# Altium project 2560_TrainingKit.PrjPcb (part 4 of 4)

## Sheet [08] - TK2560_Relay.SchDoc: 2560_TrainingKit
size A4; SheetNumber: 9; SheetTotal: 15
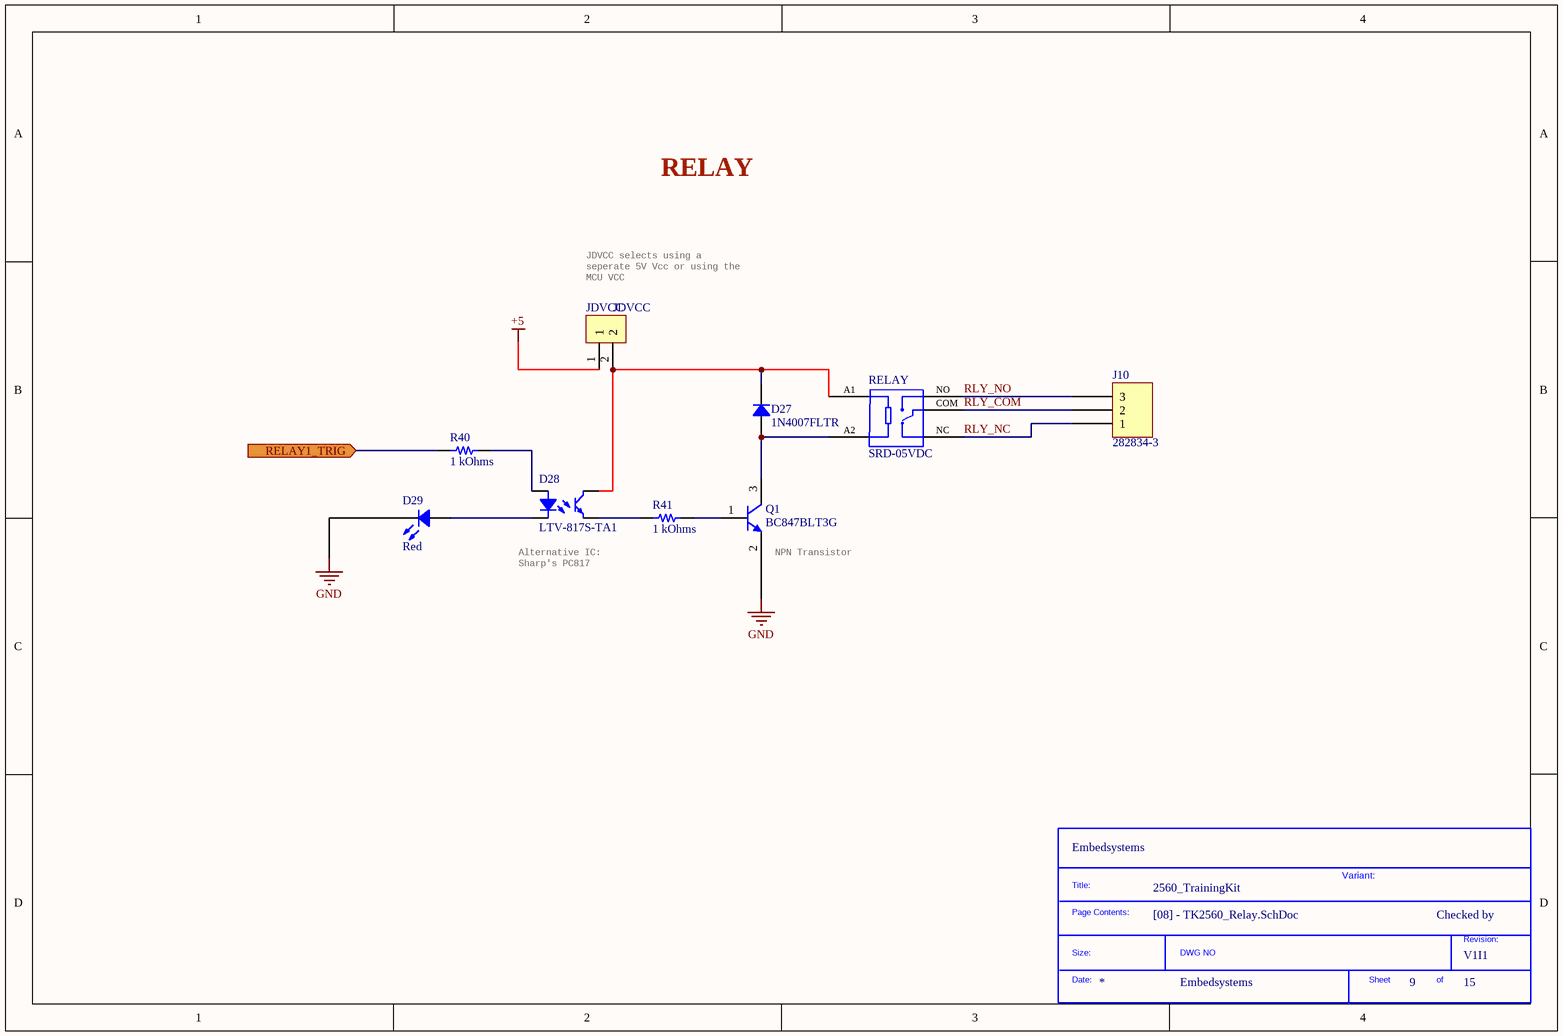
[diagram p11: [08] - TK2560_Relay.SchDoc]

### Parts
(Parts that share a designator on the sheet are numbered #1, #2 ... from top to bottom, then left to right.)
*?#9  SDTitleBlock  (value not drawn)  (graphical)
D27  1N4007FLTR  [SOD123F]
D28  LTV-817S-TA1  [LITEON LTV-817]
D29  Red  [LED 1206_3216 RED]
J10  282834-3  [TE 282834-3]
JDVCC  JDVCC  [HDR_1x2]
Q1  BC847BLT3G  [ON SEMI SOT-23-3]
R40  1 kOhms  [RES 0805_2012]
R41  1 kOhms  [RES 0805_2012]
RELAY  SRD-05VDC  [SRD-05VDC]

### Ports
RELAY1_TRIG (in)

### Nets
+5: JDVCC.1
GND: D29.2 Q1.2(E)
RELAY1_TRIG: R40.2 ; port RELAY1_TRIG
RLY_COM: J10.2 RELAY.COM
RLY_NC: J10.1 RELAY.NC
RLY_NO: J10.3 RELAY.NO
NetD27_1: D27.1 Q1.3(C) RELAY.A2
NetD27_2: D27.2 D28.4 JDVCC.2 RELAY.A1
NetD28_1: D28.1 R40.1
NetD28_2: D28.2 D29.1
NetD28_3: D28.3 R41.2
NetQ1_1: Q1.1(B) R41.1

### Notes on the sheet
- RELAY
- JDVCC selects using a seperate 5V Vcc or using the MCU VCC
- (near D28) Alternative IC: Sharp's PC817
- (near Q1) NPN Transistor
- Variant:
- Checked by
- (in symbol SDTitleBlock) Title:; Page Contents:; Revision:; Size:; DWG NO; Date:; Sheet; of

### Library data of the parts
D27 = 1N4007FLTR: STANDARD RECTIFIER 1000V SOD-123; Manufacturer: SMC Diode Solutions; Capacitance @ Vr, F: 15pF @ 4V, 1MHz; Current - Average Rectified (Io): 1A; Current - Reverse Leakage @ Vr: 5µA @ 1000V; Speed: Standard Recovery >500ns, > 200mA (Io); Voltage - Forward (Vf) (Max) @ If: 1.1V @ 1A; Part Number: 1N4007FLTR; ComponentLink1Description: Datasheet; ComponentLink1URL: http://www.smc-diodes.com/propdf/1N4001FL-1N4007FL%20N1646%20REV.A.pdf; ComponentLink2Description: DigiKey Link; ComponentLink2URL: http://digikey.com/product-detail/en/smc-diode-solutions/1N4007FLTR/1655-1N4007FLCT-ND/11657827; Diode Type: Standard; LastUpdated: 30/08/2020 20:59:55; Lifecycle Status: Active; Minimum Order: 1; Mounting Type: Surface Mount; Package / Case: SOD-123F; Packaging: TapeAndReel; PartId: 3314; Price: 0.01; Supplier 1: DigiKey; Supplier Part Number 1: 1655-1N4007FLCT-ND; Supplier Device Package: SOD-123FL; Voltage - DC Reverse (Vr) (Max): 1000V
D28 = LTV-817S-TA1: OPTOISOLATR 5KV TRANSISTOR 4-SMD; Manufacturer: Lite-On Inc.; Current - DC Forward (If) (Max): 50mA; Current Transfer Ratio (Max): 600% @ 5mA; Current Transfer Ratio (Min): 50% @ 5mA; Input Type: DC; Number of Channels: 1; Rise / Fall Time (Typ): 4µs, 3µs; Vce Saturation (Max): 200mV; Voltage - Forward (Vf) (Typ): 1.2V; Voltage - Isolation: 5000Vrms; Voltage - Output (Max): 35V; Part Number: LTV-817S-TA1; ComponentLink1Description: Datasheet; ComponentLink1URL: http://optoelectronics.liteon.com/upload/download/DS-70-96-0016/LTV-8X7%20series%20201610%20.pdf; ComponentLink2Description: DigiKey Link; ComponentLink2URL: http://digikey.com/product-detail/en/lite-on-inc/LTV-817S-TA1/160-1893-1-ND/3306757; Current - Output / Channel: 50mA; Device Package: 4-SMD, Gull Wing; LastUpdated: 12/01/2020 21:58:48; Lifecycle Status: Active; Minimum Order: 1; Mounting Type: Surface Mount; Operating Temperature: -30°C ~ 110°C; Output Type: Transistor; Package / Case: 4-SMD, Gull Wing; Packaging: TapeAndReel; Part Status: Active; Price: 0.12; Series: -; Supplier 1: DigiKey; Supplier Part Number 1: 160-1893-1-ND; Supplier Device Package: 4-SMD
D29 = XZMDK55W-A2RT: LED RED CLEAR 2SMD; Manufacturer: SunLED; Configuration: Standard; Current - Test: 20mA; Lens Color: Colorless; Lens Size: 1.10mm Dia; Lens Style: Round with Flat Top; Millicandela Rating: 228mcd; Viewing Angle: 70°; Voltage - Forward (Vf) (Typ): 1.95V; Wavelength - Dominant: 630nm; Wavelength - Peak: 645nm; Part Number: XZMDK55W-A2RT; Color: Red; ComponentLink1Description: Datasheet; ComponentLink1URL: https://www.sunledusa.com/products/spec/XZMDK55W-A2RT.pdf; ComponentLink2Description: DigiKey Link; ComponentLink2URL: http://digikey.com/product-detail/en/sunled/XZMDK55W-A2RT/1497-1289-1-ND/5775269; Device Package: 1206 (3216 Metric); Height (Max): 1.20mm; LastUpdated: 02/09/2020 01:21:09; Lens Transparency: Clear; Lifecycle Status: Active; Minimum Order: 1; Mounting Type: Surface Mount; Package / Case: 1206 (3216 Metric); Packaging: TapeAndReel; PartId: 183; Part Status: Active; Price: 0.08; Series: -; Size / Dimension: 3.20mm L x 1.60mm W; Supplier 1: DigiKey; Supplier Part Number 1: 1497-1289-1-ND; Supplier Device Package: 2-SMD; Value: Red
J10 = 282834-3: TERM BLK 3P SIDE ENT 2.54MM PCB; Manufacturer: TE Connectivity AMP Connectors; Current: 10A; Mating Orientation: Horizontal with Board; Number of Levels: 1; Pitch: 0.100" (2.54mm); Positions Per Level: 3; Voltage: 150V; Wire Gauge: 16-30 AWG; Wire Termination: Screw - Rising Cage Clamp; Part Number: 282834-3; Color: Green; ComponentLink1Description: Datasheet; ComponentLink1URL: https://www.te.com/commerce/DocumentDelivery/DDEController?Action=srchrtrv&DocNm=282834&DocType=Customer+Drawing&DocLang=English; ComponentLink2Description: DigiKey Link; ComponentLink2URL: http://digikey.com/product-detail/en/te-connectivity-amp-connectors/282834-3/A98334-ND/1153264; LastUpdated: 15/01/2020 04:15:50; Lifecycle Status: Active; Minimum Order: 1; Mounting Type: Through Hole; Packaging: Bulk; Part Status: Active; Price: 2.01; Series: Buchanan; Supplier 1: DigiKey; Supplier Part Number 1: A98334-ND
JDVCC = HDR_1x2: Pin Header 2.54MM Pitch Str, 1X2PIN, Full G/f, NY6T, 6.1MM*2.5MM*3.0MM / Bag; Manufacturer: Amphenol; Manufacturer Part Number: G800W306018EU; Supplier 1: Mouser; Stock 1: 1088; Pricing 1: 1=0.10000, 10=0.02700, 50=0.02700, 100=0.02600, 1000=0.02200, 10000=0.01900 (USD); RoHS Compliant: Yes; Supplier Part Number 1: 523-G800W306018EU
Q1 = BC847BLT3G: TRANS NPN 45V 0.1A SOT-23; Manufacturer: ON Semiconductor; Current - Collector Cutoff (Max): 15nA (ICBO); Current - Collector (Ic) (Max): 100mA; DC Current Gain (hFE) (Min) @ Ic, Vce: 200 @ 2mA, 5V; Frequency - Transition: 100MHz; Power - Max: 300mW; Vce Saturation (Max) @ Ib, Ic: 600mV @ 5mA, 100mA; Part Number: BC847BLT3G; ComponentLink1Description: Datasheet; ComponentLink1URL: http://www.onsemi.com/pub/Collateral/BC846ALT1-D.PDF; ComponentLink2Description: DigiKey Link; ComponentLink2URL: http://digikey.com/product-detail/en/on-semiconductor/BC847BLT3G/BC847BLT3GOSCT-ND/2704957; LastUpdated: 02/09/2020 01:30:08; Lifecycle Status: Active; Minimum Order: 1; Mounting Type: Surface Mount; Operating Temperature: -55°C ~ 150°C (TJ); Package / Case: TO-236-3, SC-59, SOT-23-3; Packaging: TapeAndReel; PartId: 157; Part Status: Active; Price: 0.02; Series: -; Supplier 1: DigiKey; Supplier Part Number 1: BC847BLT3GOSCT-ND; Supplier Device Package: SOT-23-3 (TO-236); Transistor Type: NPN; Voltage - Collector Emitter Breakdown (Max): 45V
R40 R41 = RNCP0805FTD1K00: RES 1K OHM 1% 1/4W 0805; Manufacturer: Stackpole Electronics Inc; Power (Watts): 0.25W, 1/4W; Temperature Coefficient: ±100ppm/°C; Part Number: RNCP0805FTD1K00; Value: 1 kOhms; ComponentLink1Description: Datasheet; ComponentLink1URL: https://www.seielect.com/catalog/sei-rncp.pdf; ComponentLink2Description: DigiKey Link; ComponentLink2URL: http://digikey.com/product-detail/en/stackpole-electronics-inc/RNCP0805FTD1K00/RNCP0805FTD1K00CT-ND/2240568; Composition: Thin Film; Device Package: 0805 (2012 Metric); Features: Anti-Sulfur, Moisture Resistant; Height - Seated (Max): 0.024" (0.60mm); LastUpdated: 02/09/2020 01:15:23; Lifecycle Status: Active; Minimum Order: 1; Number of Terminations: 2; Operating Temperature: -55°C ~ 155°C; Package / Case: 0805 (2012 Metric); Packaging: TapeAndReel; PartId: 28023; Part Status: Active; Price: 0.01; Resistance: 1 kOhms; Series: RNCP; Size / Dimension: 0.079" L x 0.049" W (2.00mm x 1.25mm); Supplier 1: DigiKey; Supplier Part Number 1: RNCP0805FTD1K00CT-ND; Supplier Device Package: 0805; Tolerance: ±1%
RELAY = SRD-05VDC: TE CONNECTIVITY - 1-1721150-0 - POWER RELAY, SPDT, 277VAC, 10A, TH; Manufacturer: TE Connectivity P&B; Contact Current Rating: 15A; Coil Voltage (DC): 5V; Voltage Rating (AC): 125V; Manufacturer Part Number: 1-1721150-0; RoHS: Yes; Category: Signal Relays; Stock 1: 9261; Pricing 1: 1=1.34000, 10=1.26000, 25=1.12000, 50=1.06400, 100=1.00800, 250=0.89600, 500=0.84000, 1000=0.78400, 5000=0.75600 (USD); Mount: Through Hole; Number of Pins: 5; Weight: 9.5g; Max Operating Temperature: 85°C; Packaging: Rail/Tube; Throw Configuration: SPDT; Termination: PCB; Length: 19mm; Width: 15.5mm; Height: 15.8mm; Depth: 15.5mm; Lead Free: Lead Free; ELV: Compliant; ComponentLink1URL: https://datasheet.ciiva.com/14189/eng-cd-1721150-c-14189465.pdf?src-supplier=Avnet; ComponentLink1Description: https://datasheet.ciiva.com/14189/eng-cd-1721150-c-14189465.pdf?src-supplier=Avnet; ComponentLink2URL: https://datasheet.ciiva.com/48542/eng-cd-1721150-c-48542490.pdf?src-supplier=Onlinecomponents.com; ComponentLink2Description: https://datasheet.ciiva.com/48542/eng-cd-1721150-c-48542490.pdf?src-supplier=Onlinecomponents.com; Supplier 1: Digi-Key; Supplier Part Number 1: PB2032-ND

## Sheet [12] - TK2560_uSD.SchDoc: 2560_TrainingKit
size A4; SheetNumber: 13; SheetTotal: 15
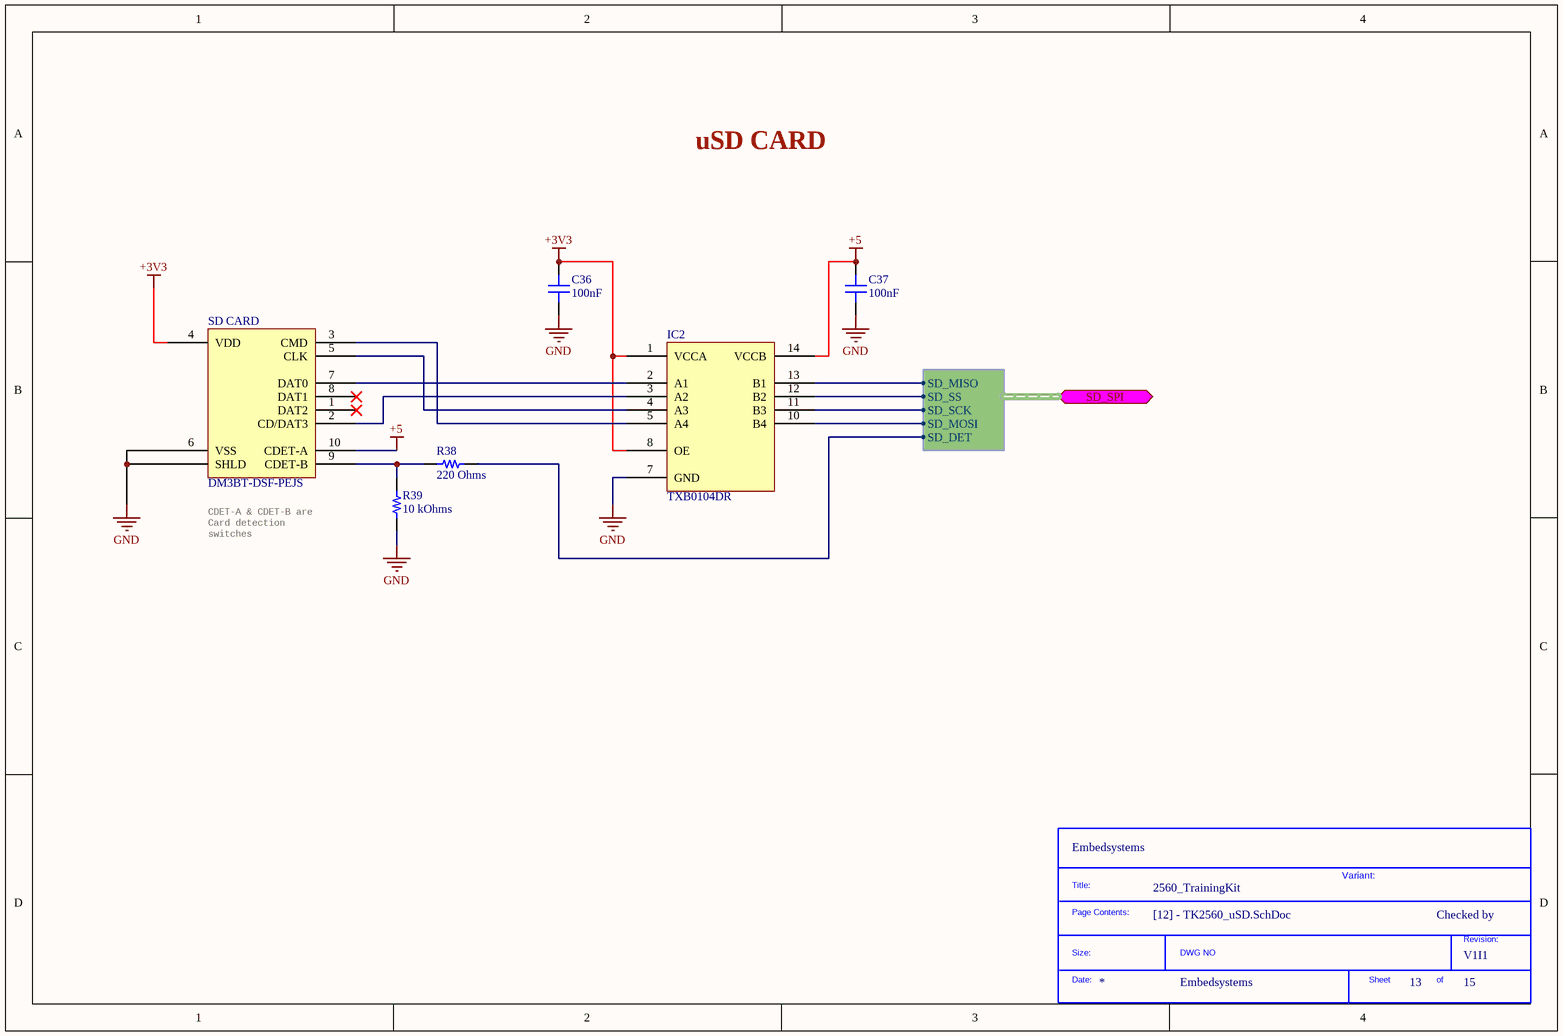
[diagram p12: [12] - TK2560_uSD.SchDoc]

### Parts
(Parts that share a designator on the sheet are numbered #1, #2 ... from top to bottom, then left to right.)
*?#10  SDTitleBlock  (value not drawn)  (graphical)
C36  100nF  [CAP 0805_2012]
C37  100nF  [CAP 0805_2012]
IC2  TXB0104DR  [TI SOIC-14 D]
R38  220 Ohms  [RES 0805_2012]
R39  10 kOhms  [RES 0805_2012]
SD_CARD  DM3BT-DSF-PEJS  [HIROSE DM3BT-DSF-PEJS]

### Ports
SD_SPI (bidir, harness SD_SPI)

### Harnesses
SD_SPI: SD_MISO, SD_SS, SD_SCK, SD_MOSI, SD_DET

### Nets
+3V3: C36.2 IC2.1(VCCA) IC2.8(OE) SD_CARD.4(VDD)
+5: C37.2 IC2.14(VCCB) SD_CARD.10(CDET-A)
GND: C36.1 C37.1 IC2.7(GND) R39.2 SD_CARD.6(VSS) SD_CARD.S(SHLD)
NetIC2_2: IC2.2(A1) SD_CARD.7(DAT0)
NetIC2_3: IC2.3(A2) SD_CARD.2(CD/DAT3)
NetIC2_4: IC2.4(A3) SD_CARD.5(CLK)
NetIC2_5: IC2.5(A4) SD_CARD.3(CMD)
NetIC2_10: IC2.10(B4) ; port SD_SPI.SD_MOSI
NetIC2_11: IC2.11(B3) ; port SD_SPI.SD_SCK
NetIC2_12: IC2.12(B2) ; port SD_SPI.SD_SS
NetIC2_13: IC2.13(B1) ; port SD_SPI.SD_MISO
NetR38_1: R38.1 R39.1 SD_CARD.9(CDET-B)
NetR38_2: R38.2 ; port SD_SPI.SD_DET

Not connected (* = marked no-connect by the designer): SD_CARD 1(DAT2)* 8(DAT1)*

### Notes on the sheet
- uSD CARD
- (near SD_CARD) CDET-A & CDET-B are Card detection switches
- Variant:
- Checked by
- (in symbol SDTitleBlock) Title:; Page Contents:; Revision:; Size:; DWG NO; Date:; Sheet; of

### Library data of the parts
C36 C37 = AC0805KKX8R9BB104: as C2 on sheet [03] - TK2560_MCU; Part Number: AC0805KKX8R9BB104; Value: 100nF; Applications: Automotive; ComponentLink1Description: Datasheet; ComponentLink1URL: http://www.yageo.com/documents/recent/AC0805KKX8R9BB104.pdf; ComponentLink2Description: DigiKey Link; ComponentLink2URL: http://digikey.com/product-detail/en/yageo/AC0805KKX8R9BB104/311-4624-1-ND/9699550; Device Package: 0805 (2012 Metric); LastUpdated: 02/09/2020 01:04:20; Lifecycle Status: Active; Minimum Order: 1; Mounting Type: Surface Mount, MLCC; Operating Temperature: -55°C ~ 150°C; Package / Case: 0805 (2012 Metric); Packaging: TapeAndReel; PartId: 14076; Part Status: Active; Price: 0.06; Ratings: AEC-Q200; Series: AC; Size / Dimension: 0.079" L x 0.049" W (2.00mm x 1.25mm); Supplier 1: DigiKey; Supplier Part Number 1: 311-4624-1-ND; Temperature Coefficient: X8R; Thickness (Max): 0.057" (1.45mm); Tolerance: ±10%; Voltage - Rated: 50V
IC2 = TXB0104DR: IC TRNSLTR BIDIRECTIONAL 14SOIC; Manufacturer: Texas Instruments; Channels per Circuit: 4; Data Rate: 100Mbps; Number of Circuits: 1; Output Type: Tri-State, Non-Inverted; Translator Type: Voltage Level; Voltage - VCCA: 1.2V ~ 3.6V; Voltage - VCCB: 1.65V ~ 5.5V; Part Number: TXB0104DR; Channel Type: Bidirectional; ComponentLink1Description: Datasheet; ComponentLink1URL: http://www.ti.com/general/docs/suppproductinfo.tsp?distId=10&gotoUrl=http%3A%2F%2Fwww.ti.com%2Flit%2Fgpn%2Ftxb0104; ComponentLink2Description: DigiKey Link; ComponentLink2URL: http://digikey.com/product-detail/en/texas-instruments/TXB0104DR/296-21928-1-ND/1629281; Device Package: 14-SOIC (0.154", 3.90mm Width); Features: Auto-Direction Sensing; LastUpdated: 13/05/2020 17:06:13; Lifecycle Status: Active; Minimum Order: 1; Mounting Type: Surface Mount; Operating Temperature: -40°C ~ 85°C (TA); Package / Case: 14-SOIC (0.154", 3.90mm Width); Packaging: TapeAndReel; Part Status: Active; Price: 0.54; Series: -; Supplier 1: DigiKey; Supplier Part Number 1: 296-21928-1-ND; Supplier Device Package: 14-SOIC
R38 = ERJ-6ENF2200V: RES SMD 220 OHM 1% 1/8W 0805; Manufacturer: Panasonic Electronic Components; Power (Watts): 0.125W, 1/8W; Temperature Coefficient: ±100ppm/°C; Part Number: ERJ-6ENF2200V; Value: 220 Ohms; ComponentLink1Description: Datasheet; ComponentLink1URL: https://industrial.panasonic.com/cdbs/www-data/pdf/RDA0000/AOA0000C304.pdf; ComponentLink2Description: DigiKey Link; ComponentLink2URL: http://digikey.com/product-detail/en/panasonic-electronic-components/ERJ-6ENF2200V/P220CCT-ND/1746831; Composition: Thick Film; Device Package: 0805 (2012 Metric); Features: Automotive AEC-Q200; Height - Seated (Max): 0.028" (0.70mm); LastUpdated: 02/09/2020 01:15:19; Lifecycle Status: Active; Minimum Order: 1; Number of Terminations: 2; Operating Temperature: -55°C ~ 155°C; Package / Case: 0805 (2012 Metric); Packaging: TapeAndReel; PartId: 30101; Part Status: Active; Price: 0.01; Ratings: AEC-Q200; Resistance: 220 Ohms; Series: ERJ; Size / Dimension: 0.079" L x 0.049" W (2.00mm x 1.25mm); Supplier 1: DigiKey; Supplier Part Number 1: P220CCT-ND; Supplier Device Package: 0805; Tolerance: ±1%
R39 = CPF0805B10KE: RES SMD 10K OHM 0.1% 1/10W 0805; Manufacturer: TE Connectivity Passive Product; Power (Watts): 0.1W, 1/10W; Temperature Coefficient: ±25ppm/°C; Part Number: CPF0805B10KE; Value: 10 kOhms; ComponentLink1Description: Datasheet; ComponentLink1URL: https://www.te.com/commerce/DocumentDelivery/DDEController?Action=srchrtrv&DocNm=1773200&DocType=DS&DocLang=English; ComponentLink2Description: DigiKey Link; ComponentLink2URL: http://digikey.com/product-detail/en/te-connectivity-passive-product/CPF0805B10KE/A106043CT-ND/3477679; Composition: Thin Film; Device Package: 0805 (2012 Metric); Height - Seated (Max): 0.026" (0.65mm); LastUpdated: 02/09/2020 01:15:24; Lifecycle Status: Active; Minimum Order: 1; Number of Terminations: 2; Operating Temperature: -55°C ~ 155°C; Package / Case: 0805 (2012 Metric); Packaging: TapeAndReel; PartId: 27724; Part Status: Active; Price: 0.09; Resistance: 10 kOhms; Series: CPF, Neohm; Size / Dimension: 0.079" L x 0.049" W (2.00mm x 1.25mm); Supplier 1: DigiKey; Supplier Part Number 1: A106043CT-ND; Supplier Device Package: 0805; Tolerance: ±0.1%
SD_CARD = DM3BT-DSF-PEJS: CONN MICRO SD CARD PUSH-PUSH R/A; Manufacturer: Hirose Electric Co Ltd; Card Type: Secure Digital - microSD™; Connector Type: Connector and Ejector; Insertion, Removal Method: Push In, Push Out; Number of Positions: 10 (8 + 2); Part Number: DM3BT-DSF-PEJS; ComponentLink1Description: Datasheet; ComponentLink1URL: https://www.hirose.com/product/download/?distributor=digikey&type=specSheet&lang=en&num=DM3BT-DSF-PEJS; ComponentLink2Description: DigiKey Link; ComponentLink2URL: //digikey.com/product-detail/en/hirose-electric-co-ltd/DM3BT-DSF-PEJS/HR1942TR-ND/1982749; Contact Finish: Gold; Features: Switch; Height Above Board: 0.072" (1.83mm); LastUpdated: 16/12/2019 20:35:34; Lifecycle Status: 0; Minimum Order: 1; Mounting Feature: Reverse - Bottom; Mounting Type: Surface Mount, Right Angle; Packaging: TapeAndReel; Part Status: Active; Price: 1.25; Series: DM3; Supplier 1: DigiKey; Supplier Part Number 1: HR1942TR-ND

## Sheet [14] - TK2560_RevisionHistory.SchDoc: 2560_TrainingKit
size A4; DocumentNumber: 4; SheetNumber: 15; SheetTotal: 15
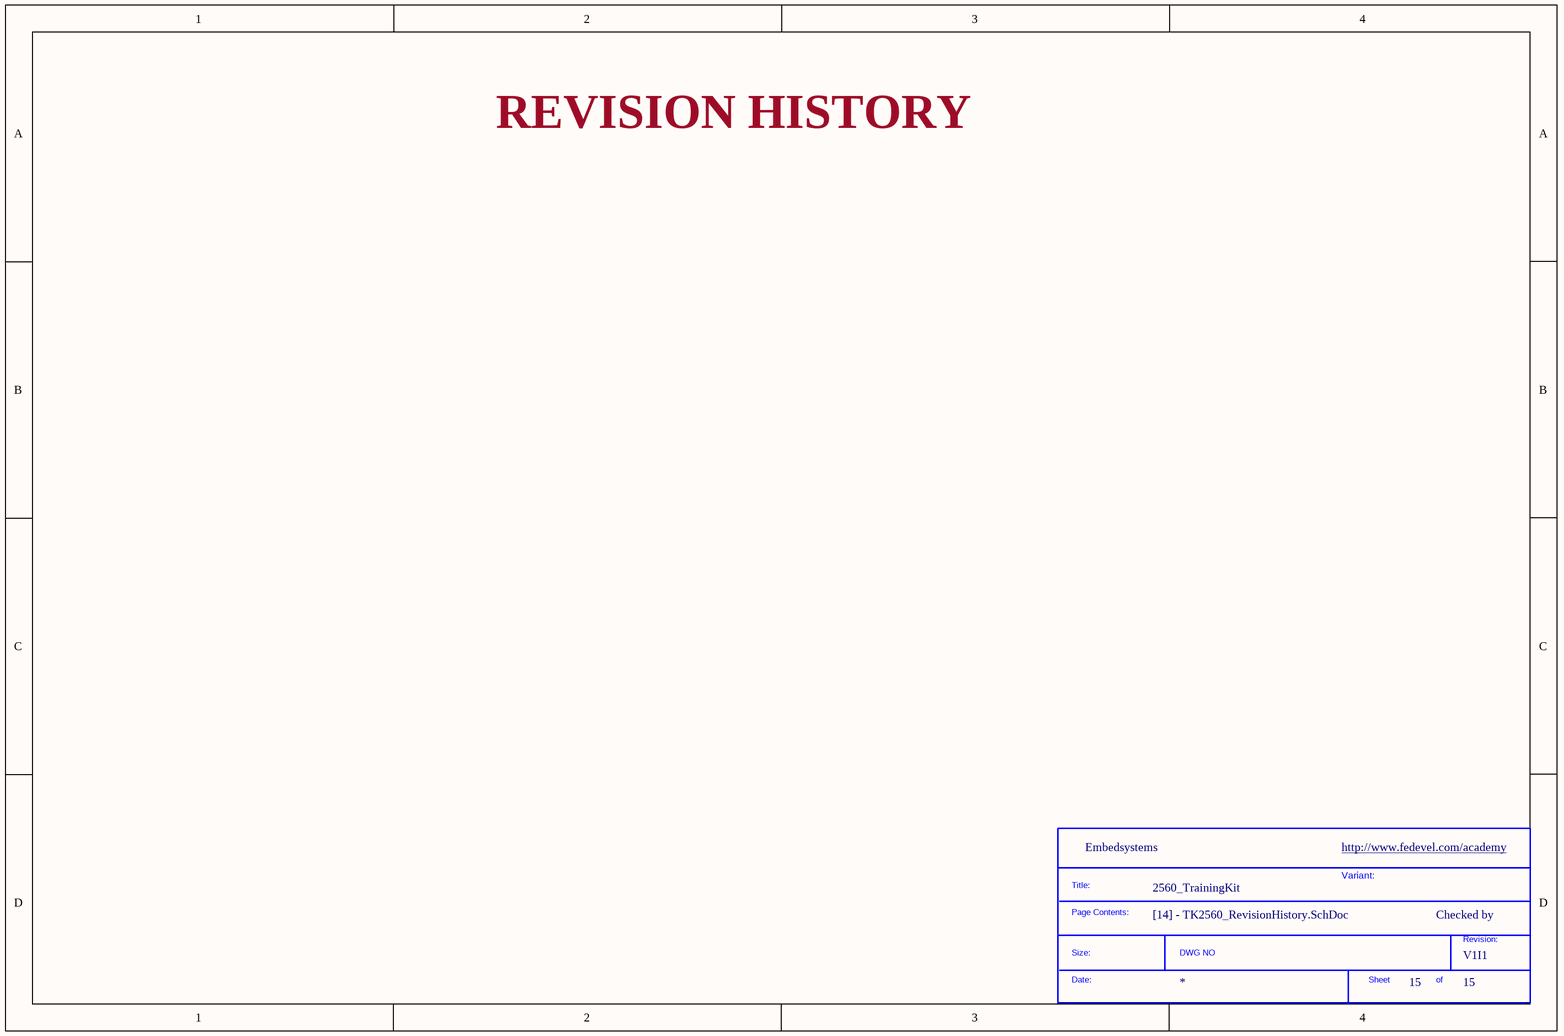
[diagram p13: [14] - TK2560_RevisionHistory.SchDoc]

### Parts
(Parts that share a designator on the sheet are numbered #1, #2 ... from top to bottom, then left to right.)
*#3  SDTitleBlock  (value not drawn)  (graphical)

### Notes on the sheet
- REVISION HISTORY
- http://www.fedevel.com/academy
- Variant:
- Checked by
- (in symbol SDTitleBlock) Title:; Page Contents:; Revision:; Size:; DWG NO; Date:; Sheet; of

## Sheet [13] - TK2560_GPIO.SchDoc: 2560_TrainingKit
size A4; SheetNumber: 14; SheetTotal: 15
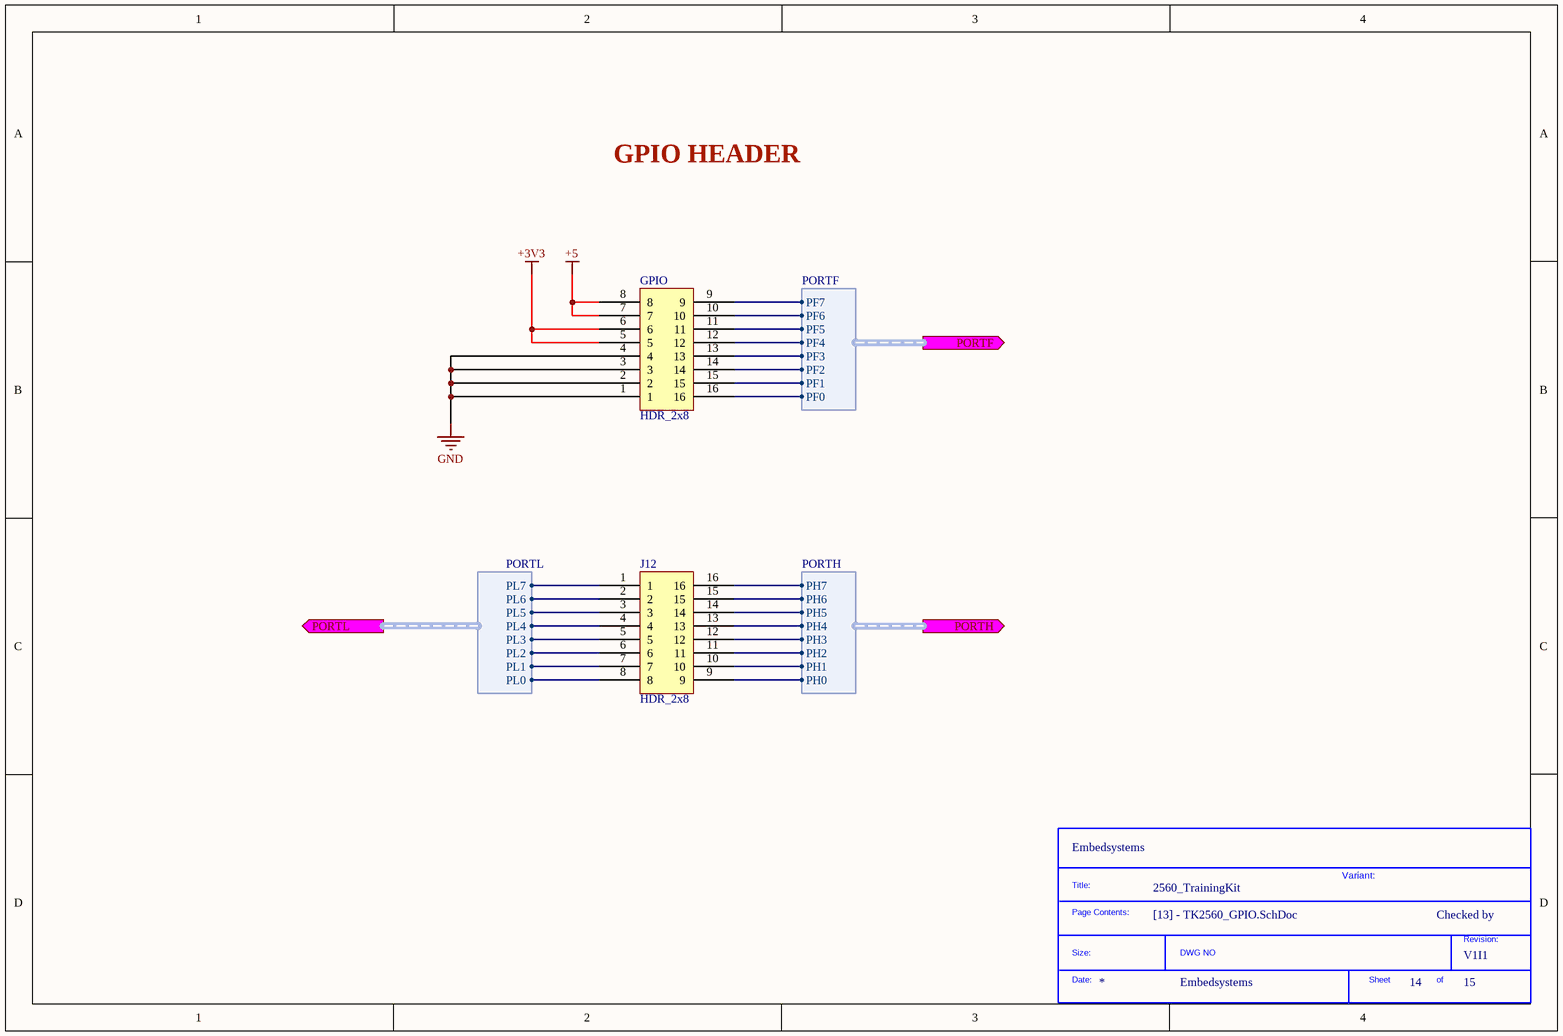
[diagram p14: [13] - TK2560_GPIO.SchDoc]

### Parts
(Parts that share a designator on the sheet are numbered #1, #2 ... from top to bottom, then left to right.)
*?#11  SDTitleBlock  (value not drawn)  (graphical)
GPIO  HDR_2x8  [HDR_2x8]
J12  HDR_2x8  [HDR_2x8]

### Ports
PORTF (out, harness PORTF), PORTH (out, harness PORTH), PORTL (out, harness PORTL)

### Harnesses
PORTF: PF0, PF1, PF2, PF3, PF4, PF5, PF6, PF7
PORTH: PH0, PH1, PH2, PH3, PH4, PH5, PH6, PH7
PORTL: PL0, PL1, PL2, PL3, PL4, PL5, PL6, PL7

### Nets
+3V3: GPIO.5 GPIO.6
+5: GPIO.7 GPIO.8
GND: GPIO.1 GPIO.2 GPIO.3 GPIO.4
NetGPIO_9: GPIO.9 ; port PORTF.PF7
NetGPIO_10: GPIO.10 ; port PORTF.PF6
NetGPIO_11: GPIO.11 ; port PORTF.PF5
NetGPIO_12: GPIO.12 ; port PORTF.PF4
NetGPIO_13: GPIO.13 ; port PORTF.PF3
NetGPIO_14: GPIO.14 ; port PORTF.PF2
NetGPIO_15: GPIO.15 ; port PORTF.PF1
NetGPIO_16: GPIO.16 ; port PORTF.PF0
NetJ12_1: J12.1 ; port PORTL.PL7
NetJ12_2: J12.2 ; port PORTL.PL6
NetJ12_3: J12.3 ; port PORTL.PL5
NetJ12_4: J12.4 ; port PORTL.PL4
NetJ12_5: J12.5 ; port PORTL.PL3
NetJ12_6: J12.6 ; port PORTL.PL2
NetJ12_7: J12.7 ; port PORTL.PL1
NetJ12_8: J12.8 ; port PORTL.PL0
NetJ12_9: J12.9 ; port PORTH.PH0
NetJ12_10: J12.10 ; port PORTH.PH1
NetJ12_11: J12.11 ; port PORTH.PH2
NetJ12_12: J12.12 ; port PORTH.PH3
NetJ12_13: J12.13 ; port PORTH.PH4
NetJ12_14: J12.14 ; port PORTH.PH5
NetJ12_15: J12.15 ; port PORTH.PH6
NetJ12_16: J12.16 ; port PORTH.PH7

### Notes on the sheet
- GPIO HEADER
- Variant:
- Checked by
- (in symbol SDTitleBlock) Title:; Page Contents:; Revision:; Size:; DWG NO; Date:; Sheet; of

### Library data of the parts
GPIO J12 = HDR_2x8: CONN HDR FEMALE 16POS 0.1 GOLD PCB; Manufacturer: Sullins; Manufacturer Part Number: PPPC082LFBN-RC; Number of Positions: 16; Connector Type: Header; Pitch: 0.1inch; Supplier 1: Digi-Key; RoHS: Yes; Category: Connectors; Stock 1: 22838; Pricing 1: 1=1.03000, 10=0.90400, 100=0.78010, 500=0.63828, 1000=0.56736, 5000=0.51220 (USD); Mount: Through Hole; Color: Black; Contact Plating: Gold; Contact Material: Bronze; Housing Material: Plastic; Package Quantity: 1000; Number of Rows: 2; Packaging: Bulk; Termination: Solder; Contact Type: Female Socket; Length: 20.8mm; Width: 5mm; Height: 8.5mm; Row Spacing: 0.1inch; Lead Free: Lead Free; RoHS Compliant: Yes; ComponentLink1URL: https://media.digikey.com/pdf/Data%20Sheets/Sullins%20PDFs/Female_Headers.100_DS.pdf?src-supplier=Digi-Key; ComponentLink1Description: https://media.digikey.com/pdf/Data%20Sheets/Sullins%20PDFs/Female_Headers.100_DS.pdf?src-supplier=Digi-Key; ComponentLink2URL: http://www.sullinscorp.com/catalogs/101_Page80-81_HEADER_.100_2.54mm_FEMALE.pdf?src-supplier=Future+Electronics; ComponentLink2Description: http://www.sullinscorp.com/catalogs/101_Page80-81_HEADER_.100_2.54mm_FEMALE.pdf?src-supplier=Future+Electronics; Supplier Part Number 1: S7111-ND

## Sheet [10] - TK2560_GSMWiFi.SchDoc: 2560_TrainingKit
size A4; SheetNumber: 11; SheetTotal: 15
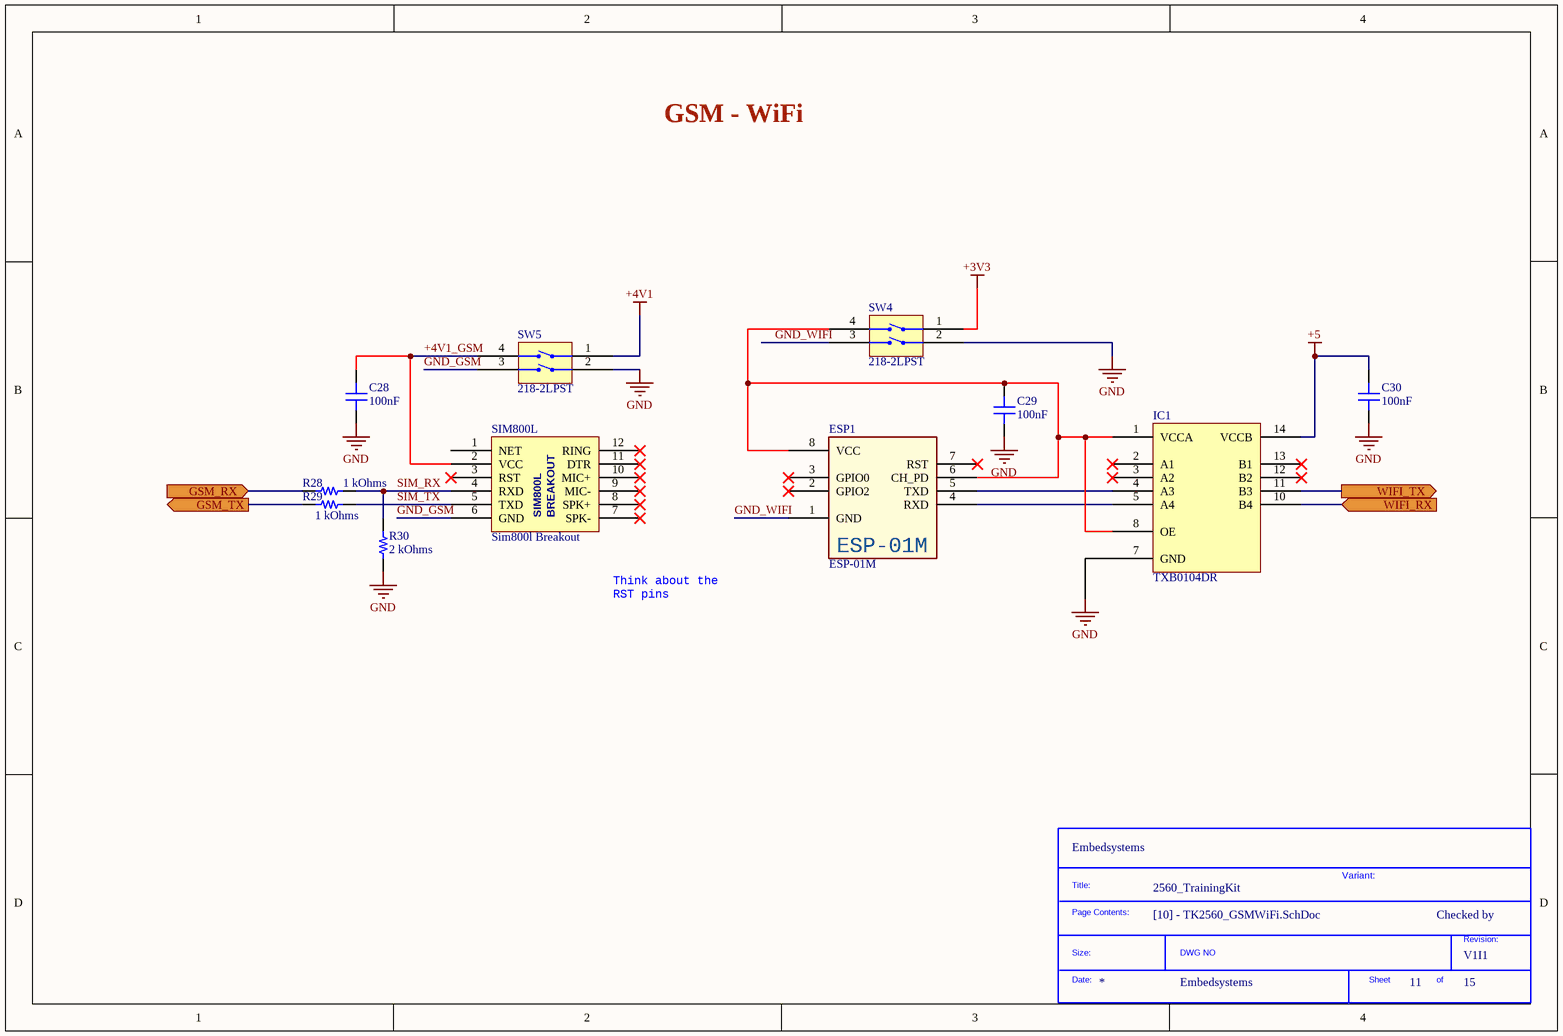
[diagram p15: [10] - TK2560_GSMWiFi.SchDoc]

### Parts
(Parts that share a designator on the sheet are numbered #1, #2 ... from top to bottom, then left to right.)
*?#12  SDTitleBlock  (value not drawn)  (graphical)
C28  100nF  [CAP 0805_2012]
C29  100nF  [CAP 0805_2012]
C30  100nF  [CAP 0805_2012]
ESP1  ESP-01M  [ESP-01]
IC1  TXB0104DR  [TI SOIC-14 D]
R28  1 kOhms  [RES 0805_2012]
R29  1 kOhms  [RES 0805_2012]
R30  2 kOhms  [RES 0805_2012]
SIM800L  Sim800l Breakout  [SIM800L_BO]
SW4  218-2LPST  [CTS 218-2LPJ]
SW5  218-2LPST  [CTS 218-2LPJ]

### Ports
GSM_RX (in), GSM_TX (out), WIFI_RX (in), WIFI_TX (out)

### Nets
+3V3: SW4.1(GND)
+4V1: SW5.1(GND)
+5: C30.2 IC1.14(VCCB)
GND: C28.1 C29.1 C30.1 IC1.7(GND) R30.1 SW4.2(GND) SW5.2(GND)
+4V1_GSM: C28.2 SIM800L.2(VCC) SW5.4(GND)
GND_GSM: SIM800L.6(GND) SW5.3(GND)
GND_WIFI: ESP1.1(GND) SW4.3(GND)
GSM_RX: R28.1 ; port GSM_RX
GSM_TX: R29.1 ; port GSM_TX
SIM_RX: R28.2 R30.2 SIM800L.4(RXD)
SIM_TX: R29.2 SIM800L.5(TXD)
WIFI_RX: IC1.10(B4) ; port WIFI_RX
WIFI_TX: IC1.11(B3) ; port WIFI_TX
NetC29_2: C29.2 ESP1.6(CH_PD) ESP1.8(VCC) IC1.1(VCCA) IC1.8(OE) SW4.4(GND)
NetESP1_4: ESP1.4(RXD) IC1.5(A4)
NetESP1_5: ESP1.5(TXD) IC1.4(A3)

Not connected (* = marked no-connect by the designer): ESP1 2(GPIO2)* 3(GPIO0)* 7(RST)*; IC1 2(A1)* 3(A2)* 12(B2)* 13(B1)*; SIM800L 1(NET) 3(RST)* 7(SPK-)* 8(SPK+)* 9(MIC-)* 10(MIC+)* 11(DTR)* 12(RING)*

### Notes on the sheet
- GSM - WiFi
- Think about the RST pins
- Variant:
- Checked by
- (in symbol SDTitleBlock) Title:; Page Contents:; Revision:; Size:; DWG NO; Date:; Sheet; of
- (in symbol Sim800l Breakout) BREAKOUT

### Library data of the parts
C28-C30 = AC0805KKX8R9BB104: CAP CER 0805 10% X8R 50V 100NF; Manufacturer: Yageo; Capacitance: 0.1µF; Part Number: AC0805KKX8R9BB104; Value: 100nF; Applications: Automotive; ComponentLink1Description: Datasheet; ComponentLink1URL: http://www.yageo.com/documents/recent/AC0805KKX8R9BB104.pdf; ComponentLink2Description: DigiKey Link; ComponentLink2URL: http://digikey.com/product-detail/en/yageo/AC0805KKX8R9BB104/311-4624-1-ND/9699550; Device Package: 0805 (2012 Metric); LastUpdated: 02/09/2020 01:04:20; Lifecycle Status: Active; Minimum Order: 1; Mounting Type: Surface Mount, MLCC; Operating Temperature: -55°C ~ 150°C; Package / Case: 0805 (2012 Metric); Packaging: TapeAndReel; PartId: 14076; Part Status: Active; Price: 0.06; Ratings: AEC-Q200; Series: AC; Size / Dimension: 0.079" L x 0.049" W (2.00mm x 1.25mm); Supplier 1: DigiKey; Supplier Part Number 1: 311-4624-1-ND; Temperature Coefficient: X8R; Thickness (Max): 0.057" (1.45mm); Tolerance: ±10%; Voltage - Rated: 50V
ESP1 = ESP-01M: TXRX ESP8266 MOD WIFI TRACE ANT; Manufacturer: Seeed Studio; Manufacturer Part Number: 317060016; RoHS: No; Category: Embedded Processors and Controllers; Stock 1: 190; Pricing 1: 1=7.09000 (USD); Case/Package: Module; Weight: 0.0625lb; Length: 3.25inch; Width: 2.25inch; Height: 0.25inch; ComponentLink1URL: https://media.digikey.com/pdf/Data%20Sheets/Seeed%20Technology/317060016_Web.pdf?src-supplier=Digi-Key; ComponentLink1Description: https://media.digikey.com/pdf/Data%20Sheets/Seeed%20Technology/317060016_Web.pdf?src-supplier=Digi-Key; Supplier 1: Digi-Key; Supplier Part Number 1: 1597-1145-ND
IC1 = TXB0104DR: IC TRNSLTR BIDIRECTIONAL 14SOIC; Manufacturer: Texas Instruments; Channels per Circuit: 4; Data Rate: 100Mbps; Number of Circuits: 1; Output Type: Tri-State, Non-Inverted; Translator Type: Voltage Level; Voltage - VCCA: 1.2V ~ 3.6V; Voltage - VCCB: 1.65V ~ 5.5V; Part Number: TXB0104DR; Channel Type: Bidirectional; ComponentLink1Description: Datasheet; ComponentLink1URL: http://www.ti.com/general/docs/suppproductinfo.tsp?distId=10&gotoUrl=http%3A%2F%2Fwww.ti.com%2Flit%2Fgpn%2Ftxb0104; ComponentLink2Description: DigiKey Link; ComponentLink2URL: http://digikey.com/product-detail/en/texas-instruments/TXB0104DR/296-21928-1-ND/1629281; Device Package: 14-SOIC (0.154", 3.90mm Width); Features: Auto-Direction Sensing; LastUpdated: 13/05/2020 17:06:13; Lifecycle Status: Active; Minimum Order: 1; Mounting Type: Surface Mount; Operating Temperature: -40°C ~ 85°C (TA); Package / Case: 14-SOIC (0.154", 3.90mm Width); Packaging: TapeAndReel; Part Status: Active; Price: 0.54; Series: -; Supplier 1: DigiKey; Supplier Part Number 1: 296-21928-1-ND; Supplier Device Package: 14-SOIC
R28 R29 = RNCS0805BKE1K00: RES 1K OHM 0.1% 1/10W 0805; Manufacturer: Stackpole Electronics Inc; Power (Watts): 0.1W, 1/10W; Temperature Coefficient: ±25ppm/°C; Part Number: RNCS0805BKE1K00; Value: 1 kOhms; ComponentLink1Description: Datasheet; ComponentLink1URL: https://www.seielect.com/catalog/sei-rncs_rnch.pdf; ComponentLink2Description: DigiKey Link; ComponentLink2URL: http://digikey.com/product-detail/en/stackpole-electronics-inc/RNCS0805BKE1K00/RNCS0805BKE1K00CT-ND/1800170; Composition: Thin Film; Device Package: 0805 (2012 Metric); Features: Anti-Corrosive, Automotive AEC-Q200, Moisture Resistant; Height - Seated (Max): 0.026" (0.65mm); LastUpdated: 02/09/2020 01:15:24; Lifecycle Status: Active; Minimum Order: 1; Number of Terminations: 2; Operating Temperature: -55°C ~ 155°C; Package / Case: 0805 (2012 Metric); Packaging: TapeAndReel; PartId: 27715; Part Status: Active; Price: 0.09; Ratings: AEC-Q200; Resistance: 1 kOhms; Series: RNCS; Size / Dimension: 0.079" L x 0.049" W (2.00mm x 1.25mm); Supplier 1: DigiKey; Supplier Part Number 1: RNCS0805BKE1K00CT-ND; Supplier Device Package: 0805; Tolerance: ±0.1%
R30 = RCS08052K00FKEA: RES SMD 2K OHM 1% 0.4W 0805; Manufacturer: Vishay Dale; Power (Watts): 0.4W, 2/5W; Temperature Coefficient: ±100ppm/°C; Part Number: RCS08052K00FKEA; Value: 2 kOhms; ComponentLink1Description: Datasheet; ComponentLink1URL: http://www.vishay.com/docs/20065/rcse3.pdf; ComponentLink2Description: DigiKey Link; ComponentLink2URL: http://digikey.com/product-detail/en/vishay-dale/RCS08052K00FKEA/541-2840-1-ND/5867133; Composition: Thick Film; Device Package: 0805 (2012 Metric); Features: Automotive AEC-Q200, Pulse Withstanding; Height - Seated (Max): 0.020" (0.50mm); LastUpdated: 02/09/2020 01:15:24; Lifecycle Status: Active; Minimum Order: 1; Number of Terminations: 2; Operating Temperature: -55°C ~ 155°C; Package / Case: 0805 (2012 Metric); Packaging: TapeAndReel; PartId: 27786; Part Status: Active; Price: 0.03; Ratings: AEC-Q200; Resistance: 2 kOhms; Series: RCS e3; Size / Dimension: 0.079" L x 0.049" W (2.00mm x 1.25mm); Supplier 1: DigiKey; Supplier Part Number 1: 541-2840-1-ND; Supplier Device Package: 0805; Tolerance: ±1%
SW4 SW5 = 218-2LPST: SWITCH SLIDE DIP SPST 25MA 24V; Manufacturer: CTS Electrocomponents; Actuator Level: Flush, Recessed; Actuator Type: Slide (Standard); Number of Positions: 2; Pitch: 0.050" (1.27mm), Half; Voltage Rating: 24VDC; Washable: Yes; Part Number: 218-2LPST; Circuit: SPST; ComponentLink1Description: Datasheet; ComponentLink1URL: https://www.ctscorp.com/wp-content/uploads/218.pdf; ComponentLink2Description: DigiKey Link; ComponentLink2URL: http://digikey.com/product-detail/en/cts-electrocomponents/218-2LPST/CT2182LPST-ND/267319; Contact Finish: Gold; Contact Material: Beryllium Copper; Current Rating (Amps): 25mA; Features: Epoxy Sealed Terminals, Tape Seal; Height Above Board: 0.104" (2.65mm); LastUpdated: 04/01/2020 18:30:26; Lifecycle Status: Active; Minimum Order: 1; Mounting Type: Surface Mount; Operating Temperature: -55°C ~ 85°C; Packaging: Tube; PartId: 3; Part Status: Active; Price: 1.04; Series: 218; Supplier 1: DigiKey; Supplier Part Number 1: CT2182LPST-ND; Termination Style: Gull Wing
SIM800L = Sim800l Breakout: Supplier1: Nerokas; ComponentLink1Description: Shop; ComponentLink1URL: https://store.nerokas.co.ke/index.php?route=product/product&product_id=1266

## Nets that join several sheets
+3V3: [04] - TK2560_Power (C21.2 U4.4 U4.5), [05] - TK2560_OutputLEDs (SEVEN_SEGMENT.3 SEVEN_SEGMENT.8), [12] - TK2560_uSD (C36.2 IC2.1 IC2.8 SD_CARD.4), [13] - TK2560_GPIO (GPIO.5 GPIO.6), [10] - TK2560_GSMWiFi (SW4.1)
+4V1: [04] - TK2560_Power (5 pins), [10] - TK2560_GSMWiFi (SW5.1)
+5: [03] - TK2560_MCU (22 pins), [04] - TK2560_Power (12 pins), [06] - TK2560_InputKeys (6 pins), [05] - TK2560_OutputLEDs (LCD_DISPLAY_1602.2 RV1.1 U6.16), [09] - TK2560_MotorDriver (SW3.1), [11] - TK2560_ISP (5 pins), [07] - TK2560_RTC (12 pins), [08] - TK2560_Relay (JDVCC.1), [12] - TK2560_uSD (C37.2 IC2.14 SD_CARD.10), [13] - TK2560_GPIO (GPIO.7 GPIO.8), [10] - TK2560_GSMWiFi (C30.2 IC1.14)
GND: [03] - TK2560_MCU (31 pins), [04] - TK2560_Power (23 pins), [06] - TK2560_InputKeys (R23.2 R25.2 R27.2), [05] - TK2560_OutputLEDs (17 pins), [09] - TK2560_MotorDriver (9 pins), [11] - TK2560_ISP (13 pins), [07] - TK2560_RTC (6 pins), [08] - TK2560_Relay (D29.2 Q1.2), [12] - TK2560_uSD (6 pins), [13] - TK2560_GPIO (GPIO.1 GPIO.2 GPIO.3 GPIO.4), [10] - TK2560_GSMWiFi (7 pins)
GSM_RX: [03] - TK2560_MCU (U1.3), [10] - TK2560_GSMWiFi (R28.1)
GSM_TX: [03] - TK2560_MCU (U1.2), [10] - TK2560_GSMWiFi (R29.1)
MOTOR_IN1: [03] - TK2560_MCU (U1.23), [09] - TK2560_MotorDriver (U9.5)
MOTOR_IN2: [03] - TK2560_MCU (U1.24), [09] - TK2560_MotorDriver (U9.7)
MOTOR_IN3: [03] - TK2560_MCU (U1.25), [09] - TK2560_MotorDriver (U9.10)
MOTOR_IN4: [03] - TK2560_MCU (U1.26), [09] - TK2560_MotorDriver (U9.12)
NetGPIO_9: [03] - TK2560_MCU (U1.90), [13] - TK2560_GPIO (GPIO.9)
NetGPIO_10: [03] - TK2560_MCU (U1.91), [13] - TK2560_GPIO (GPIO.10)
NetGPIO_11: [03] - TK2560_MCU (U1.92), [13] - TK2560_GPIO (GPIO.11)
NetGPIO_12: [03] - TK2560_MCU (U1.93), [13] - TK2560_GPIO (GPIO.12)
NetGPIO_13: [03] - TK2560_MCU (U1.94), [13] - TK2560_GPIO (GPIO.13)
NetGPIO_14: [03] - TK2560_MCU (U1.95), [13] - TK2560_GPIO (GPIO.14)
NetGPIO_15: [03] - TK2560_MCU (U1.96), [13] - TK2560_GPIO (GPIO.15)
NetGPIO_16: [03] - TK2560_MCU (J13.1 U1.97), [13] - TK2560_GPIO (GPIO.16)
NetIC2_10: [03] - TK2560_MCU (SW1.5), [12] - TK2560_uSD (IC2.10)
NetIC2_11: [03] - TK2560_MCU (SW1.6), [12] - TK2560_uSD (IC2.11)
NetIC2_12: [03] - TK2560_MCU (SW1.7), [12] - TK2560_uSD (IC2.12)
NetIC2_13: [03] - TK2560_MCU (SW1.8), [12] - TK2560_uSD (IC2.13)
NetJ12_1: [03] - TK2560_MCU (U1.42), [13] - TK2560_GPIO (J12.1)
NetJ12_2: [03] - TK2560_MCU (U1.41), [13] - TK2560_GPIO (J12.2)
NetJ12_3: [03] - TK2560_MCU (U1.40), [13] - TK2560_GPIO (J12.3)
NetJ12_4: [03] - TK2560_MCU (U1.39), [13] - TK2560_GPIO (J12.4)
NetJ12_5: [03] - TK2560_MCU (U1.38), [13] - TK2560_GPIO (J12.5)
NetJ12_6: [03] - TK2560_MCU (U1.37), [13] - TK2560_GPIO (J12.6)
NetJ12_7: [03] - TK2560_MCU (U1.36), [13] - TK2560_GPIO (J12.7)
NetJ12_8: [03] - TK2560_MCU (U1.35), [13] - TK2560_GPIO (J12.8)
NetJ12_9: [03] - TK2560_MCU (U1.12), [13] - TK2560_GPIO (J12.9)
NetJ12_10: [03] - TK2560_MCU (U1.13), [13] - TK2560_GPIO (J12.10)
NetJ12_11: [03] - TK2560_MCU (U1.14), [13] - TK2560_GPIO (J12.11)
NetJ12_12: [03] - TK2560_MCU (U1.15), [13] - TK2560_GPIO (J12.12)
NetJ12_13: [03] - TK2560_MCU (U1.16), [13] - TK2560_GPIO (J12.13)
NetJ12_14: [03] - TK2560_MCU (U1.17), [13] - TK2560_GPIO (J12.14)
NetJ12_15: [03] - TK2560_MCU (U1.18), [13] - TK2560_GPIO (J12.15)
NetJ12_16: [03] - TK2560_MCU (U1.27), [13] - TK2560_GPIO (J12.16)
NetKEYPAD1_1: [03] - TK2560_MCU (U1.53), [06] - TK2560_InputKeys (KEYPAD1.1)
NetKEYPAD1_2: [03] - TK2560_MCU (U1.54), [06] - TK2560_InputKeys (KEYPAD1.2)
NetKEYPAD1_3: [03] - TK2560_MCU (U1.55), [06] - TK2560_InputKeys (KEYPAD1.3)
NetKEYPAD1_4: [03] - TK2560_MCU (U1.56), [06] - TK2560_InputKeys (KEYPAD1.4)
NetKEYPAD1_5: [03] - TK2560_MCU (U1.57), [06] - TK2560_InputKeys (KEYPAD1.5)
NetKEYPAD1_6: [03] - TK2560_MCU (U1.58), [06] - TK2560_InputKeys (KEYPAD1.6)
NetKEYPAD1_7: [03] - TK2560_MCU (U1.59), [06] - TK2560_InputKeys (KEYPAD1.7)
NetLCD_DISPLAY_1602_4: [03] - TK2560_MCU (U1.71), [05] - TK2560_OutputLEDs (LCD_DISPLAY_1602.4)
NetLCD_DISPLAY_1602_5: [03] - TK2560_MCU (U1.72), [05] - TK2560_OutputLEDs (LCD_DISPLAY_1602.5)
NetLCD_DISPLAY_1602_6: [03] - TK2560_MCU (U1.73), [05] - TK2560_OutputLEDs (LCD_DISPLAY_1602.6)
NetLCD_DISPLAY_1602_11: [03] - TK2560_MCU (U1.75), [05] - TK2560_OutputLEDs (LCD_DISPLAY_1602.11)
NetLCD_DISPLAY_1602_12: [03] - TK2560_MCU (U1.76), [05] - TK2560_OutputLEDs (LCD_DISPLAY_1602.12)
NetLCD_DISPLAY_1602_13: [03] - TK2560_MCU (U1.77), [05] - TK2560_OutputLEDs (LCD_DISPLAY_1602.13)
NetLCD_DISPLAY_1602_14: [03] - TK2560_MCU (U1.78), [05] - TK2560_OutputLEDs (LCD_DISPLAY_1602.14)
NetLCD_DISPLAY_1602_15: [03] - TK2560_MCU (U1.74), [05] - TK2560_OutputLEDs (LCD_DISPLAY_1602.15)
NetR10_2: [03] - TK2560_MCU (U1.82), [05] - TK2560_OutputLEDs (R10.2)
NetR11_2: [03] - TK2560_MCU (U1.83), [05] - TK2560_OutputLEDs (R11.2)
NetR12_2: [03] - TK2560_MCU (U1.84), [05] - TK2560_OutputLEDs (R12.2)
NetR13_2: [03] - TK2560_MCU (U1.85), [05] - TK2560_OutputLEDs (R13.2)
NetR14_2: [03] - TK2560_MCU (U1.86), [05] - TK2560_OutputLEDs (R14.2)
NetR15_2: [03] - TK2560_MCU (U1.87), [05] - TK2560_OutputLEDs (R15.2)
NetR16_2: [03] - TK2560_MCU (U1.88), [05] - TK2560_OutputLEDs (R16.2)
NetR17_2: [03] - TK2560_MCU (U1.89), [05] - TK2560_OutputLEDs (R17.2)
NetR32_1: [03] - TK2560_MCU (SW2.7), [11] - TK2560_ISP (R32.1)
NetR34_1: [03] - TK2560_MCU (SW2.5), [11] - TK2560_ISP (R34.1)
NetR38_2: [03] - TK2560_MCU (U1.7), [12] - TK2560_uSD (R38.2)
NetSW2_6: [03] - TK2560_MCU (SW2.6), [11] - TK2560_ISP (U11.8)
NetSW2_8: [03] - TK2560_MCU (SW2.8), [11] - TK2560_ISP (U11.3)
NetU1_47: [03] - TK2560_MCU (U1.47), [05] - TK2560_OutputLEDs (U6.14)
NetU1_48: [03] - TK2560_MCU (U1.48), [05] - TK2560_OutputLEDs (U6.12)
NetU1_49: [03] - TK2560_MCU (U1.49), [05] - TK2560_OutputLEDs (U6.11)
NetU1_50: [03] - TK2560_MCU (U1.50), [05] - TK2560_OutputLEDs (U6.10)
RELAY1_TRIG: [03] - TK2560_MCU (U1.9), [08] - TK2560_Relay (R40.2)
RTC_SCL: [03] - TK2560_MCU (U1.43), [07] - TK2560_RTC (R19.2 U7.16 U8.6)
RTC_SDA: [03] - TK2560_MCU (U1.44), [07] - TK2560_RTC (R19.1 U7.15 U8.5)
U_BTN1: [03] - TK2560_MCU (U1.65), [06] - TK2560_InputKeys (R22.2)
U_BTN2: [03] - TK2560_MCU (U1.66), [06] - TK2560_InputKeys (R24.2)
U_BTN3: [03] - TK2560_MCU (U1.67), [06] - TK2560_InputKeys (R26.2)
WIFI_RX: [03] - TK2560_MCU (U1.64), [10] - TK2560_GSMWiFi (IC1.10)
WIFI_TX: [03] - TK2560_MCU (U1.63), [10] - TK2560_GSMWiFi (IC1.11)